# Altium project LMC-PWR-001.PrjPcb
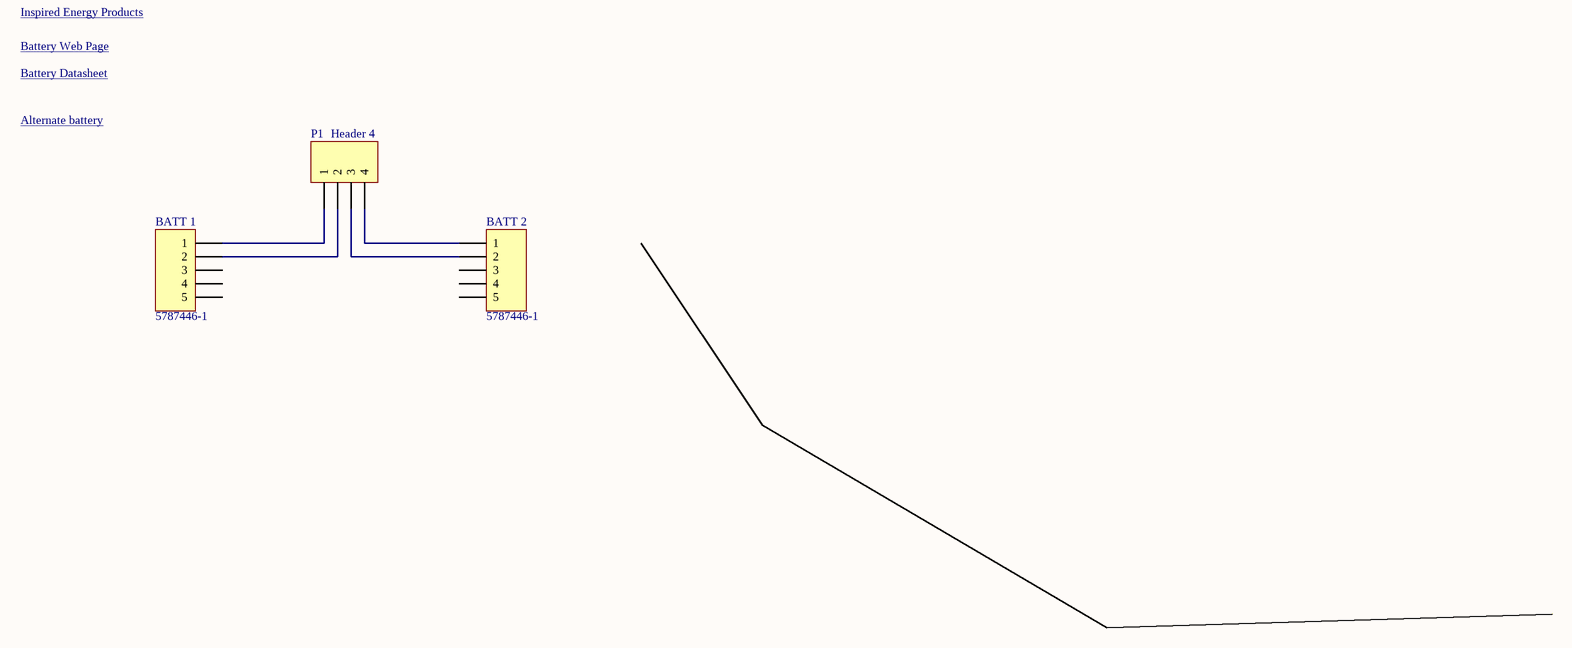
[diagram p0: LMC-PWR-001.SchDoc]
1 sheet, 3 parts. Net scope: global (net labels, ports and power ports of the same name join across sheets).
Board file: LMC-PWR-001.PcbDoc

## Sheet LMC-PWR-001.SchDoc: Battery Connector
size Tabloid; DocumentNumber: LMC-PWR-001; Revision: A; SheetNumber: 1; SheetTotal: 1

### Parts
BATT_1  5787446-1  [787446-1]
BATT_2  5787446-1  [787446-1]
P1  Header 4  [HDR1X4]

### Nets
NetBATT_1_1: BATT_1.1 P1.1
NetBATT_1_2: BATT_1.2 P1.2
NetBATT_2_1: BATT_2.1 P1.4
NetBATT_2_2: BATT_2.2 P1.3

Not connected (* = marked no-connect by the designer): BATT_1 3 4 5; BATT_2 3 4 5

### Notes on the sheet
- Battery Web Page <https://www.inspired-energy.com/products/nl2054/>
- Inspired Energy Products <https://www.inspired-energy.com/products/>
- Alternate battery <https://www.rrc-ps.com/en/products/battery-packs/standard-smart-battery-packs/rrc2040-2/details.html>
- Battery Datasheet <https://www.inspired-energy.com/wp-content/uploads/NL2054HD22-spec-v3.2.pdf>
- Title
- Size:
- Date:
- Tabloid
- Number:
- Time:
- Revision:
- Sheet
- of
- ZLS Corporation
- 7801 North Lamar Blvd.
- Suite E-184
- Austin, Texas 78752  USA
- (512) 453-0288
- File:

### Library data of the parts
BATT_1 BATT_2 = Header 5: CONN HDR 5POS 5.00MM KINKED PIN; Manufacturer: TE Connectivity AMP Connectors; Connector Style: Battery; Connector Type: Header, Male Blades; Pitch: 0.197" (5.00mm); Material - Insulation: Polyphthalamide (PPA); Supplier 1: Digi-Key; Supplier Part Number 1: 5787446-1-ND; Manufacturer Part Number: 5787446-1; RoHS: RoHS Compliant; Category: Connectors, Interconnects; Stock 1: 7048; Pricing 1: 1=3.48, 10=3.339, 120=2.78225, 600=2.36492, 1080=2.01714, 5040=1.80847 (USD); Packaging: Bulk; Part Status: Active; Mounting Type: Through Hole; Termination: Kinked Pin; Wire Gauge: -; Features: Keyless; Color: Black; Fastening Type: Push-Pull; Contact Material: Brass; Contact Finish: Nickel; Contact Finish Thickness: 74.8µin (1.90µm); Operating Temperature: -30°C ~ 70°C; Row Spacing: -; ComponentLink1URL: http://www.te.com/commerce/DocumentDelivery/DDEController?Action=srchrtrv&DocNm=5787446&DocType=Customer+Drawing&DocLang=English; ComponentLink1Description: http://www.te.com/commerce/DocumentDelivery/DDEController?Action=srchrtrv&DocNm=5787446&DocType=Customer+Drawing&DocLang=English
P1 = Header 4: Header, 4-Pin; LatestRevisionDate: 17-Jul-2002; LatestRevisionNote: Re-released for DXP Platform.; Publisher: Altium Limited